# EAGLE design Qi Lime Pi Rev 1 (EAGLE 6.3)
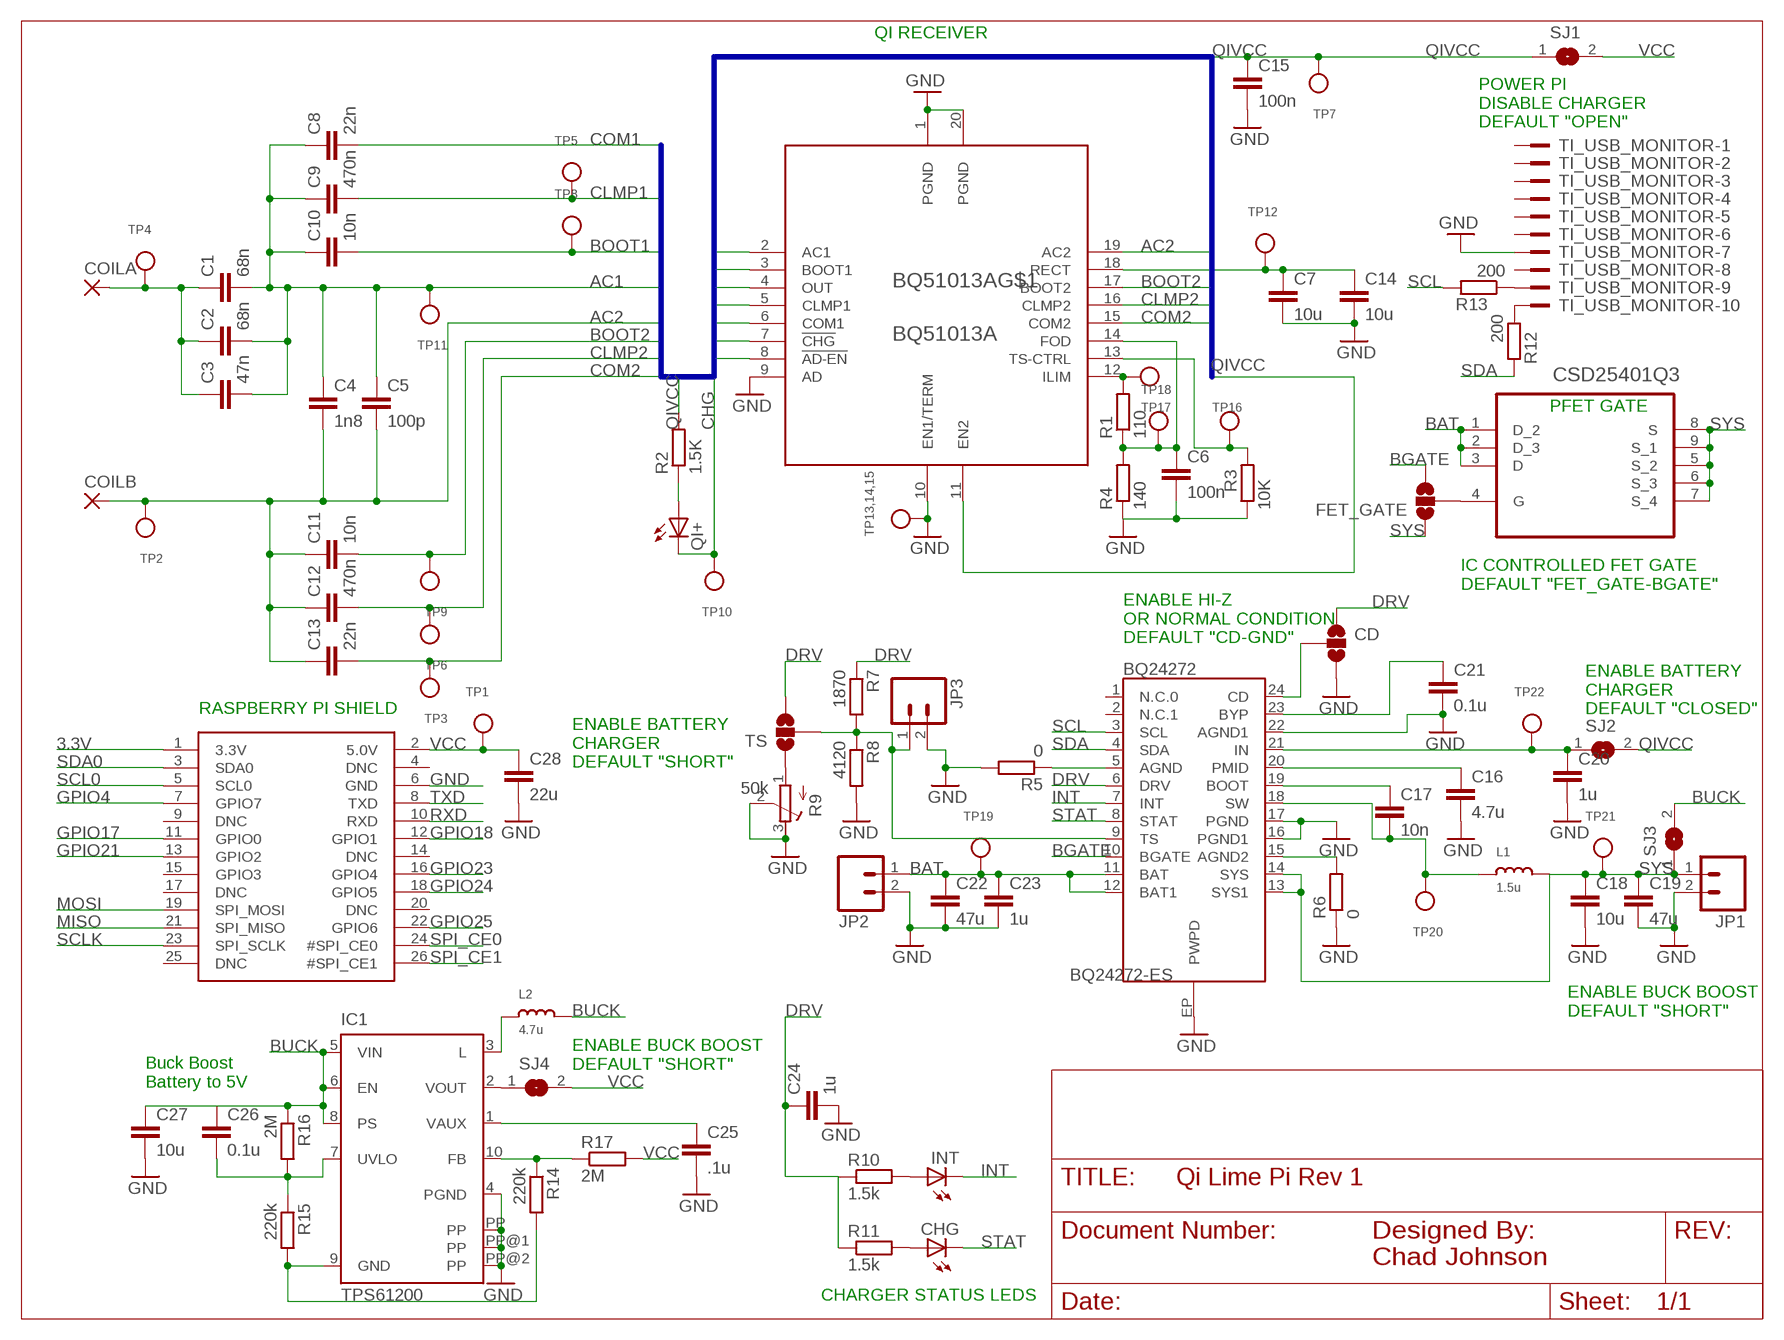
[diagram p0: schematic, sheet 1]

## Parts
BQ24272  BQ24272-ES  [QFN-24_ALT2]
BQ51013A  BQ51013A  [RHL_R-VQFN-N20]
C1  68n  C-EUC0603K  [C0603K]
C2  68n  C-EUC0603K  [C0603K]
C3  47n  C-EUC0603K  [C0603K]
C4  1n8  C-EUC0603K  [C0603K]
C5  100p  C-EUC0603K  [C0603K]
C6  100n  C-EUC0603K  [C0603K]
C7  10u  C-EUC0603K  [C0603K]
C8  22n  C-EUC0603K  [C0603K]
C9  470n  C-EUC0603K  [C0603K]
C10  10n  C-EUC0603K  [C0603K]
C11  10n  C-EUC0603K  [C0603K]
C12  470n  C-EUC0603K  [C0603K]
C13  22n  C-EUC0603K  [C0603K]
C14  10u  C-EUC0603K  [C0603K]
C15  100n  C-EUC0603K  [C0603K]
C16  4.7u  C-EUC0603K  [C0603K]
C17  10n  C-EUC0603K  [C0603K]
C18  10u  C-EUC0603K  [C0603K]
C19  47u  C-EUC0603K  [C0603K]
C20  1u  C-EUC0603K  [C0603K]
C21  0.1u  C-EUC0603K  [C0603K]
C22  47u  C-EUC0603K  [C0603K]
C23  1u  C-EUC0603K  [C0603K]
C24  1u  C-EUC0603K  [C0603K]
C25  .1u  C-EUC0603K  [C0603K]
C26  0.1u  C-EUC0603K  [C0603K]
C27  10u  C-EUC0603K  [C0603K]
C28  22u  C-EUC0603K  [C0603K]
CD  SOLDERJUMPER_2WAYS  [SJ_3]
CHG  LEDCHIP-LED0603  [CHIP-LED0603]
COILA  1,6/0,8  [1,6/0,8]
COILB  1,6/0,8  [1,6/0,8]
CSD25401Q3  CSD25401Q3  [SON65P300X300X-9N]
FET_GATE  SOLDERJUMPER_2WAYS  [SJ_3]
IC1  TPS61200  [S-PDSO-N10]
INT  LEDCHIP-LED0603  [CHIP-LED0603]
JP1  M02PTH3  [1X02_LONGPADS]
JP2  M02PTH3  [1X02_LONGPADS]
JP3  M02PTH3  [1X02_LONGPADS]
L1  1.5u  INDUCTORNR5040  [INDUCTOR_5X5MM_NR5040_NOTHERMALS]
L2  4.7u  INDUCTORNR5040  [INDUCTOR_5X5MM_NR5040_NOTHERMALS]
QI+  LEDCHIP-LED0603  [CHIP-LED0603]
R1  110  R-EU_R0402  [R0402]
R2  1.5K  R-EU_R0402  [R0402]
R3  10K  R-EU_R0402  [R0402]
R4  140  R-EU_R0402  [R0402]
R5  0  R-EU_R0402  [R0402]
R6  0  R-EU_R0402  [R0402]
R7  1870  R-EU_R0402  [R0402]
R8  4120  R-EU_R0402  [R0402]
R9  50k  R-TRIMM64Y  [RTRIM64Y]
R10  1.5k  R-EU_R0402  [R0402]
R11  1.5k  R-EU_R0402  [R0402]
R12  200  R-EU_R0402  [R0402]
R13  200  R-EU_R0402  [R0402]
R14  220k  R-EU_R0402  [R0402]
R15  220k  R-EU_R0402  [R0402]
R16  2M  R-EU_R0402  [R0402]
R17  2M  R-EU_R0402  [R0402]
SJ1  SJ  [SJ]
SJ2  SJ  [SJ]
SJ3  SJ  [SJ]
SJ4  SJ  [SJ]
TI_USB_MONITOR  2510-  [PAK100/2500-10]
TP1  TESTPOINTROUND1MM  [TESTPOINT_ROUND_1MM]
TP2  TESTPOINTROUND1MM  [TESTPOINT_ROUND_1MM]
TP3  TESTPOINTROUND1MM  [TESTPOINT_ROUND_1MM]
TP4  TESTPOINTROUND1MM  [TESTPOINT_ROUND_1MM]
TP5  TESTPOINTROUND1MM  [TESTPOINT_ROUND_1MM]
TP6  TESTPOINTROUND1MM  [TESTPOINT_ROUND_1MM]
TP7  TESTPOINTROUND1MM  [TESTPOINT_ROUND_1MM]
TP8  TESTPOINTROUND1MM  [TESTPOINT_ROUND_1MM]
TP9  TESTPOINTROUND1MM  [TESTPOINT_ROUND_1MM]
TP10  TESTPOINTROUND1MM  [TESTPOINT_ROUND_1MM]
TP11  TESTPOINTROUND1MM  [TESTPOINT_ROUND_1MM]
TP12  TESTPOINTROUND1MM  [TESTPOINT_ROUND_1MM]
TP13,14,15  TESTPOINTROUND1MM  [TESTPOINT_ROUND_1MM]
TP16  TESTPOINTROUND1MM  [TESTPOINT_ROUND_1MM]
TP17  TESTPOINTROUND1MM  [TESTPOINT_ROUND_1MM]
TP18  TESTPOINTROUND1MM  [TESTPOINT_ROUND_1MM]
TP19  TESTPOINTROUND1MM  [TESTPOINT_ROUND_1MM]
TP20  TESTPOINTROUND1MM  [TESTPOINT_ROUND_1MM]
TP21  TESTPOINTROUND1MM  [TESTPOINT_ROUND_1MM]
TP22  TESTPOINTROUND1MM  [TESTPOINT_ROUND_1MM]
TS  SOLDERJUMPER_2WAYS  [SJ_3]
U$1  RASPBERRYPI_BB  [RASBERRYPI_SHIELD]

## Nets
3.3V: U$1.1(3.3V)
AC1: BQ51013A.2(AC1) C1.2 C2.2 C3.2 C4.1 C5.1 C8.1 C9.1 C10.1 TP11.P$1
AC2: BQ51013A.19(AC2) C4.2 C5.2 C11.1 C12.1 C13.1 COILB.1(P) TP2.P$1
AD-EN: BQ51013A.8(!AD-EN)
BAT: BQ24272.11(BAT) BQ24272.12(BAT1) C22.1 C23.1 CSD25401Q3.1(D_2) CSD25401Q3.2(D_3) CSD25401Q3.3(D) JP2.1 TP19.P$1
BGATE: BQ24272.10(BGATE) FET_GATE.3
BOOT1: BQ51013A.3(BOOT1) C10.2 TP8.P$1
BOOT2: BQ51013A.17(BOOT2) C11.2 TP9.P$1
BUCK: C26.1 C27.1 IC1.5(VIN) IC1.6(EN) IC1.8(PS) L2.P$2 R16.1 SJ3.2
CHG: BQ51013A.7(!CHG) QI+.C TP10.P$1
CLMP1: BQ51013A.5(CLMP1) C9.2 TP5.P$1
CLMP2: BQ51013A.16(CLMP2) C12.2 TP6.P$1
COM1: BQ51013A.6(COM1) C8.2
COM2: BQ51013A.15(COM2) C13.2 TP3.P$1
DRV: BQ24272.6(DRV) C24.1 CD.1 R7.1 R10.1 R11.1 TS.3
FOD: BQ51013A.14(FOD) C6.1 R1.1 R4.2 TP17.P$1
GND: BQ24272.16(PGND1) BQ24272.17(PGND) BQ24272.22(AGND1) BQ24272.EP(PWPD) BQ51013A.1(PGND) BQ51013A.9(AD) BQ51013A.10(EN1/TERM) BQ51013A.20(PGND) C6.2 C7.2 C14.2 C15.2 C16.2 C18.2 C19.2 C20.2 C21.2 C22.2 C23.2 C24.2 C25.2 C27.2 C28.2 CD.3 IC1.4(PGND) IC1.PP IC1.PP@1(PP) IC1.PP@2(PP) JP1.2 JP2.2 JP3.2 R3.1 R4.1 R5.2 R6.1 R8.2 R9.2(S) R9.3(E) TI_USB_MONITOR.7 TP13,14,15.P$1 U$1.6(GND)
GPIO4: U$1.7(GPIO7)
GPIO17: U$1.11(GPIO0)
GPIO18: U$1.12(GPIO1)
GPIO21: U$1.13(GPIO2)
GPIO23: U$1.16(GPIO4)
GPIO24: U$1.18(GPIO5)
GPIO25: U$1.22(GPIO6)
INT: BQ24272.7(INT) INT.C
MISO: U$1.21(SPI_MISO)
MOSI: U$1.19(SPI_MOSI)
N$1: BQ51013A.12(ILIM) R1.2 TP18.P$1
N$2: BQ24272.5(AGND) R5.1
N$3: BQ24272.21(IN) C20.1 SJ2.1 TP22.P$1
N$4: R9.1(A) TS.1
N$5: BQ24272.20(PMID) C16.1
N$6: BQ24272.19(BOOT) C17.1
N$7: C1.1 C2.1 C3.1 COILA.1(P) TP4.P$1
N$8: BQ24272.18(SW) C17.2 L1.P$1 TP20.P$1
N$9: BQ24272.23(BYP) C21.1
N$24: BQ24272.15(AGND2) R6.2
N$71: BQ24272.24(CD) CD.2
N$72: BQ24272.9(TS) JP3.1 R7.2 R8.1 TS.2
N$73: INT.A R10.2
N$74: CHG.A R11.2
N$75: R13.1 TI_USB_MONITOR.9
N$81: R12.1 TI_USB_MONITOR.10
N$147: CSD25401Q3.4(G) FET_GATE.2
N$148: C25.1 IC1.1(VAUX)
N$149: BQ51013A.13(TS-CTRL) R3.2 TP16.P$1
N$150: QI+.A R2.1
N$151: IC1.3(L) L2.P$1
N$152: IC1.10(FB) R14.1 R17.1
N$153: C26.2 IC1.7(UVLO) R15.1 R16.2
N$154: IC1.2(VOUT) SJ4.1
N$155: IC1.9(GND) R14.2 R15.2
QIVCC: BQ51013A.4(OUT) BQ51013A.11(EN2) C15.1 R2.2 SJ1.1 SJ2.2 TP7.P$1
RECT: BQ51013A.18(RECT) C7.1 C14.1 TP12.P$1
RXD: U$1.10(RXD)
SCL: BQ24272.3(SCL) R13.2
SCL0: U$1.5(SCL0)
SCLK: U$1.23(SPI_SCLK)
SDA: BQ24272.4(SDA) R12.2
SDA0: U$1.3(SDA0)
SPI_CE0: U$1.24(#SPI_CE0)
SPI_CE1: U$1.26(#SPI_CE1)
STAT: BQ24272.8(STAT) CHG.C
SYS: BQ24272.13(SYS1) BQ24272.14(SYS) C18.1 C19.1 CSD25401Q3.5(S_2) CSD25401Q3.6(S_3) CSD25401Q3.7(S_4) CSD25401Q3.8(S) CSD25401Q3.9(S_1) FET_GATE.1 JP1.1 L1.P$2 SJ3.1 TP21.P$1
TXD: U$1.8(TXD)
VCC: C28.1 R17.2 SJ1.2 SJ4.2 TP1.P$1 U$1.2(5.0V)
Unconnected: BQ24272.1(N.C.0) BQ24272.2(N.C.1) BQ51013A.EXP@1(EXP1) BQ51013A.EXP@2(EXP2) BQ51013A.EXP@3(EXP3) BQ51013A.EXP@4(EXP4) BQ51013A.EXP@5(EXP5) BQ51013A.EXP@6(EXP6) BQ51013A.EXP@7(EXP7) TI_USB_MONITOR.1 TI_USB_MONITOR.2 TI_USB_MONITOR.3 TI_USB_MONITOR.4 TI_USB_MONITOR.5 TI_USB_MONITOR.6 TI_USB_MONITOR.8 U$1.4(DNC) U$1.9(DNC) U$1.14(DNC) U$1.15(GPIO3) U$1.17(DNC) U$1.20(DNC) U$1.25(DNC)

## Buses
AC1,BOOT1,OUT,CLMP1,COM1,CHG,AD-EN,AD,AC2,RECT,BOOT2,CLMP2,COM2,FOD,TS-CTRL,ILIM

## Notes on the sheet
- QI RECEIVER
- POWER PI
  DISABLE CHARGER
  DEFAULT "OPEN"
- PFET GATE
- IC CONTROLLED FET GATE
  DEFAULT "FET_GATE-BGATE"
- ENABLE HI-Z
  OR NORMAL CONDITION
  DEFAULT "CD-GND"
- RASPBERRY PI SHIELD
- ENABLE BATTERY
  CHARGER
  DEFAULT "CLOSED"
- ENABLE BATTERY
  CHARGER
  DEFAULT "SHORT"
- ENABLE BUCK BOOST
  DEFAULT "SHORT"
- ENABLE BUCK BOOST
  DEFAULT "SHORT"
- Buck Boost
  Battery to 5V
- Designed By:
  Chad Johnson
- CHARGER STATUS LEDS

## Library data of the parts
BQ24272 = chad1:BQ24272: Allegro A6282 16-Channel Constant-Current LED Driver Packages: TSSOP-24, 24-pin QFN Last modified: 8/20/10 Unproven!
BQ51013A = bq500211_bq500210_bq51013a:BQ51013A: Integrated Wireless Power Supply Receiver, Qi Compliant
C1 C2 = resistor:C-EU: CAPACITOR, European symbol; MF: KEMET; MPN: C0603C682K5RACTU; OC_NEWARK: 70K9097
C3 = resistor:C-EU: CAPACITOR, European symbol; MPN: C0603C473K5RACTU; OC_NEWARK: 53M7213
C4 = resistor:C-EU: CAPACITOR, European symbol; MPN: C0603C182K5RACTU; OC_NEWARK: 29T8997
C5 = resistor:C-EU: CAPACITOR, European symbol; MF: KEMET; MPN: C0603C101K5RACTU; OC_NEWARK: 72J6357
C6 C7 C9-C12 C14-C28 = resistor:C-EU: CAPACITOR, European symbol; OC_NEWARK: unknown
C8 C13 = resistor:C-EU: CAPACITOR, European symbol; MF: KEMET; MPN: C0603C223K5RACTU; OC_NEWARK: 03C3260
CD FET_GATE TS = chad1:SOLDERJUMPER_2WAY: Solder Jumper 2 way solder jumper
CHG INT = led:LED: LED
COILA COILB = wirepad:1,6/0,8: THROUGH-HOLE PAD; OC_NEWARK: unknown
CSD25401Q3 = TI-CSD25401Q3:CSD25401Q3: P-Channel NexFET Power MOSFETs,SON 3 × 3 Plastic; MPN: CSD25401Q3; OC_FARNELL: 1710779; OC_NEWARK: 15R0844; PACKAGE: SON8- 3 × 3; SUPPLIER: TEXAS INSTRUMENTS
IC1 = texas:TPS6120*: LOW INPUT VOLTAGE SYNCHRONOUS BOOST CONVERTER WITH 1.3-A SWITCHES Source: http://focus.ti.com/lit/ds/symlink/tps61200.pdf; MPN: TPS61200DRCT; OC_FARNELL: 1471238; OC_NEWARK: 37M0066
JP1-JP3 = chad1:M02: Header 2 Standard 2-pin 0.1" header. Use with straight break away headers (SKU : PRT-00116), right angle break away headers (PRT-00553), swiss pins (PRT-00743), machine pins (PRT-00117), and female headers (PRT-00115). Molex polarized connector foot print use with SKU : PRT-08233 with associated crimp pins and housings.
L1 L2 = microbuilder1:INDUCTOR: Inductors 0603: 10nH Ceramic Inductor - microwire antenna/RF (Digikey: 712-1434-2-ND) 0805: 560nH Ceramic Inductor - RF (Digikey: 553-1047-1-ND) 270nH Ceramic Inductor - Q = 40@250MHz, +-5%, 1 Ohm DC Resistance (Digikey: 535-10506-2-ND) 1007 (2518 Metric) SMT: 10µH 10% 250mOhm 820mA 1007 Inductor (Digikey: 587-2189-1-ND) 22µH 10% 500mOhm 580mA 1007 Inductor (Digikey: 587-2190-1-ND) 47µH 10% 950mOhm 420mA 1007 Inductor (Digikey: 587-2191-1-ND) 47µH 5% 100mOhm 1A 1008 Inductor (Digikey: 732-1816-1-ND) 5.0x5.0mm (Taiyo Yuden NR5040 Series) 6.8µH 20% 2.3A 64mOhm Inductor (Digikey: 587-2374-2-ND) 5.0x5.0mm (TDK VLC5045 Series) 4.7µH 20% 3.3A 34mOhm Inductor (Digikey: 445-6526-1-ND) 6.8µH 20% 2.7A 46mOhm Inductor (Digikey: 445-6527-1-ND) 6.0x6.0mm (TDK VLC6045 Series) 4.7µH 20% 3.8A 27mOhm Inductor (Digikey: 445-6538-2-ND) 6.8µH 20% 3A 41mOhm Inductor (Digikey: 445-6540-1-ND) 6.2µH 30% 2.2A 45mOhm Inductor (Digikey: SRR5028-6R2YCT-ND) - Not TDK VLC6045 but footprint should match 6.0x6.0mm (TDK SLF6045 Series) 6.8uH 30% 2A 33mOhm Inductor (Digikey: 445-4572-1-ND, Mouser: 810-SLF645T6R8N2R0PF)
QI+ = adafruit:LED: LED
R1-R8 R10-R17 = resistor:R-EU_: RESISTOR, European symbol; MPN: ERJ3EKF3000V; OC_NEWARK: 65T8414
R9 = rcl:R-TRIMM: Trimm resistor
SJ1-SJ4 = jumper:SJ: SMD solder JUMPER
TI_USB_MONITOR = con-3m:2510-: 3M (TM) Pak 100 4-Wall Header Source: 3M; MF: 3M; MPN: 2510-6002UB; OC_FARNELL: 9838244; OC_NEWARK: 46F4725
TP1-TP12 TP13,14,15 TP16-TP22 = microbuilder:TESTPOINT: Test Point Various test points for characterisation and PCB testing TESTPOINT_SMT - Compact Surface Mount Test Point [Digikey: 5016KTR-ND]
U$1 = microbuilder1:RASPBERRYPI_B

## Board
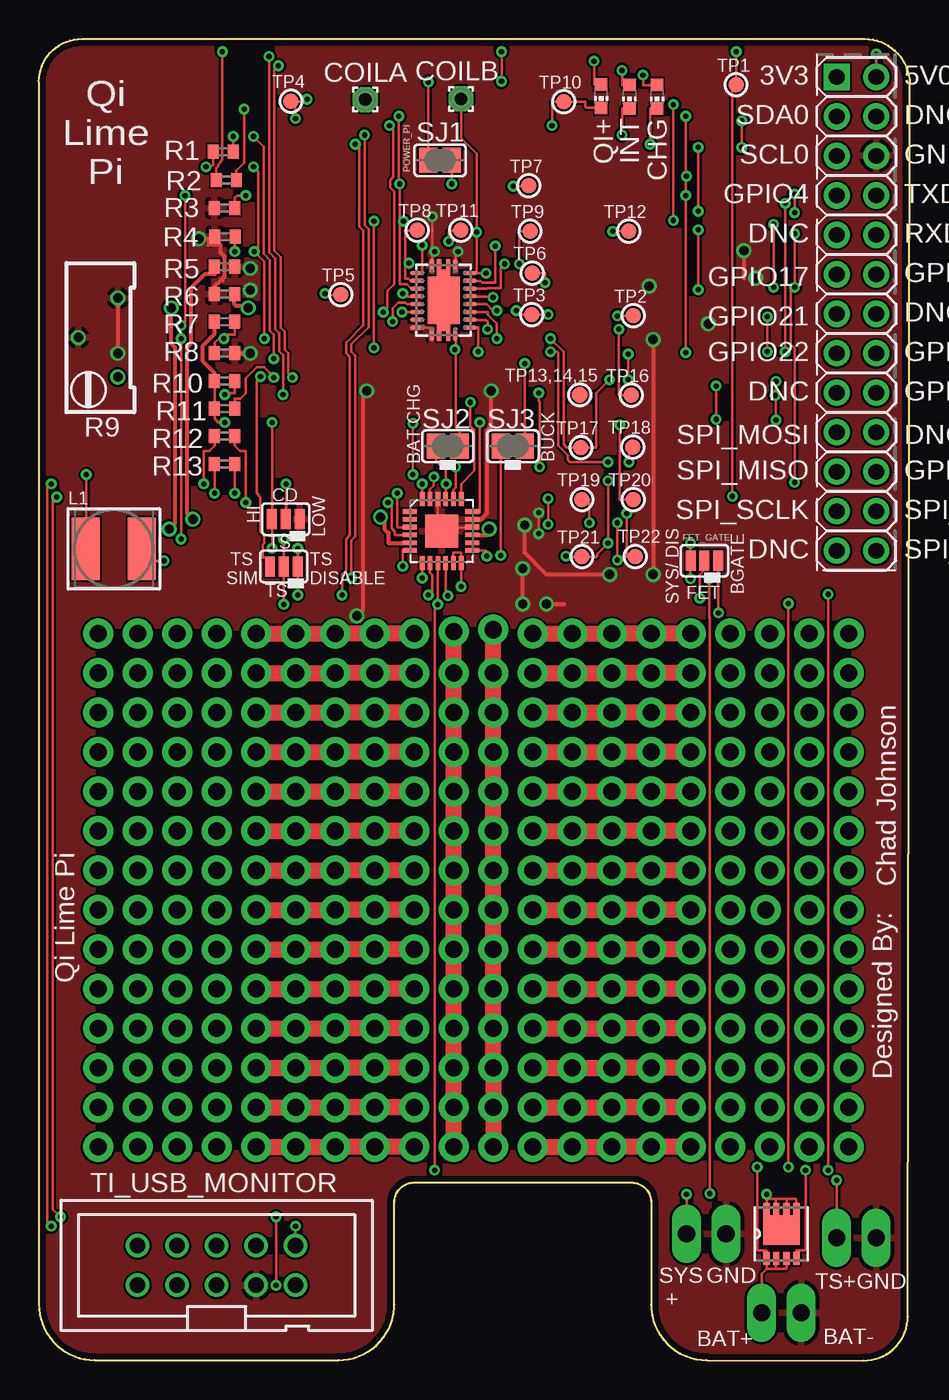
[diagram p1: board, top side]
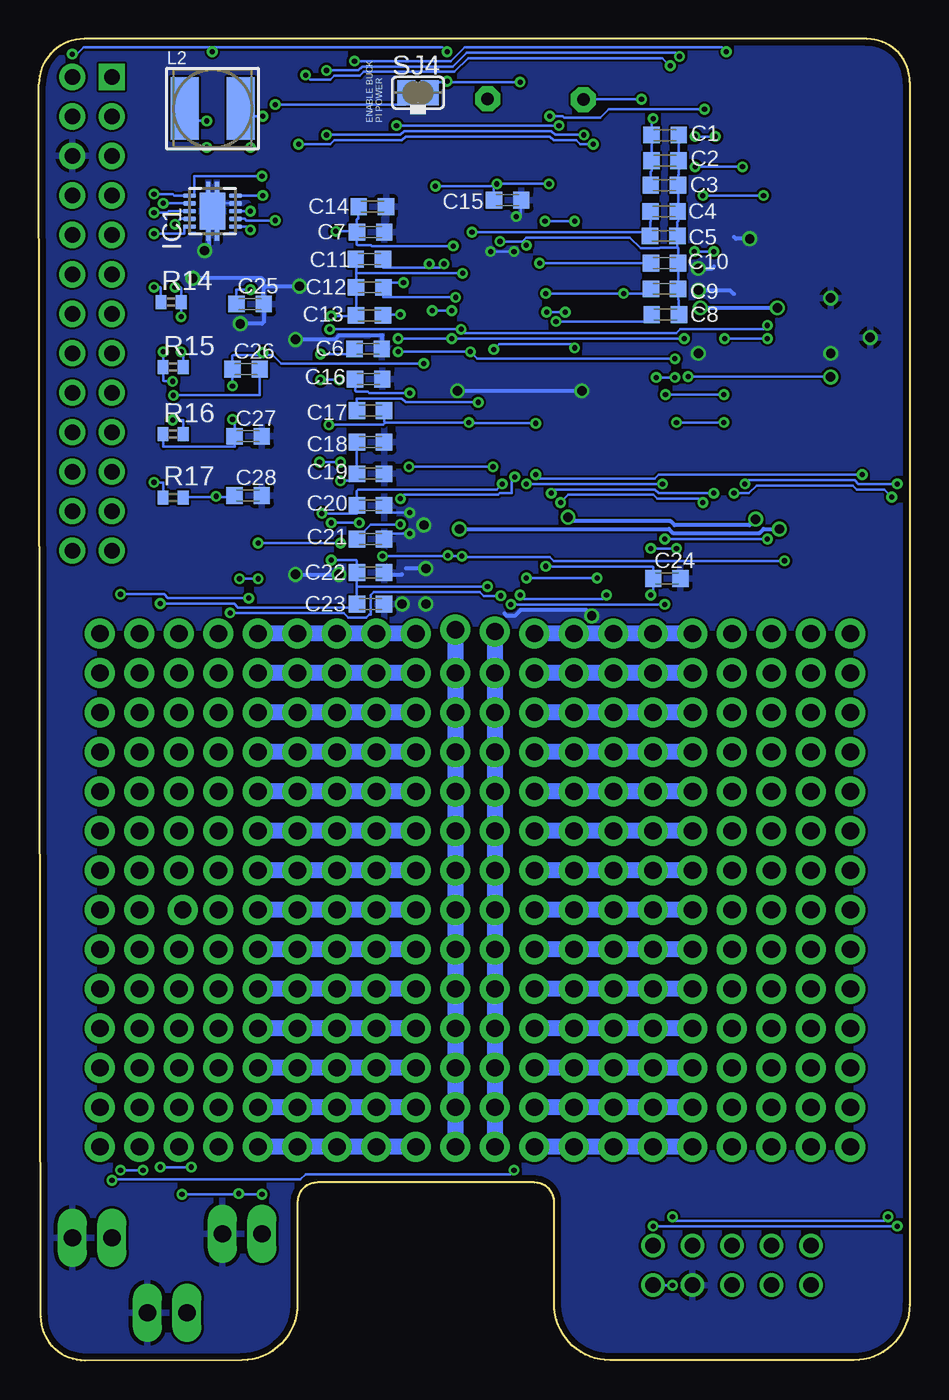
[diagram p2: board, bottom side, seen from below]

Size 56 x 85.03 mm. Coordinates in mm from the lower left corner, seen from the top.
Copper layers (1*16): Top 0.0356mm / dielectric 1.5011mm / Bottom 0.0356mm
Design rules "LaenPCBOrder": minimum track width 6mil, minimum drill 13mil, track to track 6mil, track to pad 6mil, pad to pad 6mil, via to via 6mil, smd to smd 6mil, copper to edge 15mil, drill to drill 6mil, minimum pad ring 7mil, minimum via ring 7mil, stop-mask expansion 4mil, vias tented up to drill 0mil, thermal gap 10mil

### Footprints (pad centres in the part's own frame; a part is rotated, then mirrored left to right if it is on the bottom)
QFN-24_ALT2 = smd 0.9 x 0.3: 1 -2.05,1.25; 2 -2.05,0.75; 3 -2.05,0.25; 4 -2.05,-0.25; 5 -2.05,-0.75; 6 -2.05,-1.25; 13 1.95,-1.25; 14 1.95,-0.75; 15 1.95,-0.25; 16 1.95,0.25; 17 1.95,0.75; 18 1.95,1.25 | smd 0.3 x 0.9: 7 -1.25,-2.05; 8 -0.75,-2.05; 9 -0.25,-2.05; 10 0.25,-2.05; 11 0.75,-2.05; 12 1.25,-2.05; 19 1.25,2.05; 20 0.75,2.05; 21 0.25,2.05; 22 -0.25,2.05; 23 -0.75,2.05; 24 -1.25,2.05 | smd 2.1 x 2.1: EP 0,0
RHL_R-VQFN-N20 = smd 0.85 x 0.28: 1 -2.225,-0.75; 10 2.225,-0.75; 11 2.225,0.75; 20 -2.225,0.75 | smd 0.28 x 0.85: 2 -1.75,-1.725; 3 -1.25,-1.725; 4 -0.75,-1.725; 5 -0.25,-1.725; 6 0.25,-1.725; 7 0.75,-1.725; 8 1.25,-1.725; 9 1.75,-1.725; 12 1.75,1.725; 13 1.25,1.725; 14 0.75,1.725; 15 0.25,1.725; 16 -0.25,1.725; 17 -0.75,1.725; 18 -1.25,1.725; 19 -1.75,1.725 | smd 3.05 x 2.05: EXP@1 0,0 | smd 1.125 x 0.28: EXP@2 2.075,-0.3; EXP@4 2.075,0.3; EXP@5 -2.075,0.3; EXP@7 -2.075,-0.3 | smd 0.45 x 0.4: EXP@3 1.75,0; EXP@6 -1.75,0
C0603K = smd 1.05 x 1.08: 1 -0.875,0; 2 0.875,0
SJ_3 = smd 0.635 x 1.27: 1 -0.889,0; 2 0,0; 3 0.889,0
CHIP-LED0603 = smd 0.8 x 0.8: A 0,-0.75; C 0,0.75
1,6/0,8 = drill 0.813 pad 1.6 octagon: 1 0,0
SON65P300X300X-9N = smd 0.864 x 0.406: 1 -1.575,0.965; 2 -1.575,0.33; 3 -1.575,-0.33; 4 -1.575,-0.965; 5 1.575,-0.965; 6 1.575,-0.33; 7 1.575,0.33; 8 1.575,0.965 | smd 1.9 x 2.357: 9 0.25,0
S-PDSO-N10 = smd 0.28 x 0.85: 1 -1,-1.475; 2 -0.5,-1.475; 3 0,-1.475; 4 0.5,-1.475; 5 1,-1.475; 6 1,1.475; 7 0.5,1.475; 8 0,1.475; 9 -0.5,1.475; 10 -1,1.475 | smd 2.4 x 1.65: PP 0,0 | smd 3.8 x 0.28: PP@1 0,0.275; PP@2 0,-0.275
1X02_LONGPADS = drill 1.118 pad 1.88 long: 1 0,0; 2 2.54,0
INDUCTOR_5X5MM_NR5040_NOTHERMALS = smd 1.8 x 4: P$1 -1.8,0; P$2 1.8,0
R0402 = smd 0.7 x 0.9: 1 -0.65,0; 2 0.65,0
RTRIM64Y = drill 0.61: 1 0,-2.54; 2 -2.54,0; 3 0,2.54
SJ = smd 1.168 x 1.6: 1 -0.762,0; 2 0.762,0
PAK100/2500-10 = drill 1 pad 1.422: 1 -5.08,-1.27; 2 -5.08,1.27; 3 -2.54,-1.27; 4 -2.54,1.27; 5 0,-1.27; 6 0,1.27; 7 2.54,-1.27; 8 2.54,1.27; 9 5.08,-1.27; 10 5.08,1.27
TESTPOINT_ROUND_1MM = smd 1 x 1: P$1 0,0
RASBERRYPI_SHIELD = drill 1 pad 1.676 square: 1 51.308,82.55 | drill 1 pad 1.676: 2 53.848,82.55; 3 51.308,80.01; 4 53.848,80.01; 5 51.308,77.47; 6 53.848,77.47; 7 51.308,74.93; 8 53.848,74.93; 9 51.308,72.39; 10 53.848,72.39; 11 51.308,69.85; 12 53.848,69.85; 13 51.308,67.31; 14 53.848,67.31; 15 51.308,64.77; 16 53.848,64.77; 17 51.308,62.23; 18 53.848,62.23; 19 51.308,59.69; 20 53.848,59.69; 21 51.308,57.15; 22 53.848,57.15; 23 51.308,54.61; 24 53.848,54.61; 25 51.308,52.07; 26 53.848,52.07

### Placement (x,y rotation side)
BQ24272  25.91,53.37 0 top
BQ51013A  26.03,68.22 270 top
C1  15.73,78.84 0 bottom
C2  15.74,77.18 0 bottom
C3  15.78,75.61 0 bottom
C4  15.79,73.93 180 bottom
C5  15.82,72.35 180 bottom
C6  34.83,65.09 0 bottom
C7  34.66,72.59 0 bottom
C8  15.71,67.29 180 bottom
C9  15.77,68.95 180 bottom
C10  15.77,70.59 180 bottom
C11  34.74,70.86 0 bottom
C12  34.72,69.04 0 bottom
C13  34.74,67.24 0 bottom
C14  34.55,74.23 0 bottom
C15  25.86,74.65 0 bottom
C16  34.8,63.15 0 bottom
C17  34.67,61.12 0 bottom
C18  34.67,59.08 0 bottom
C19  34.67,57.05 0 bottom
C20  34.67,55.02 0 bottom
C21  34.67,52.86 0 bottom
C22  34.67,50.7 0 bottom
C23  34.67,48.67 0 bottom
C24  15.62,50.32 0 bottom
C25  42.42,67.97 0 bottom
C26  42.67,63.78 0 bottom
C27  42.55,59.46 0 bottom
C28  42.55,55.65 0 bottom
CD  15.88,54.13 0 top
CHG  39.75,81.31 180 top
COILA  20.99,81.12 0 top
COILB  27.15,81.17 0 top
CSD25401Q3  47.75,8.16 90 top
FET_GATE  42.8,51.46 0 top
IC1  44.83,73.94 90 bottom
INT  37.97,81.31 180 top
JP1  41.66,8.16 0 top
JP2  46.48,3.08 0 top
JP3  51.31,7.9 0 top
L1  4.83,52.23 0 top
L2  44.83,80.55 0 bottom
QI+  36.16,81.34 180 top
R1  11.86,77.78 0 top
R2  12.06,75.93 0 top
R3  11.94,74.15 0 top
R4  11.97,72.31 0 top
R5  11.94,70.39 0 top
R6  11.94,68.61 0 top
R7  11.94,66.83 0 top
R8  11.94,64.8 0 top
R9  5.08,65.81 0 top
R10  11.94,63.02 0 top
R11  11.94,61.24 0 top
R12  11.94,59.46 0 top
R13  11.94,57.69 0 top
R14  47.5,68.1 0 bottom
R15  47.37,63.91 0 bottom
R16  47.37,59.59 0 bottom
R17  47.37,55.53 0 bottom
SJ1  25.8,77.22 180 top
SJ2  26.29,58.83 0 top
SJ3  30.48,58.83 0 top
SJ4  31.62,81.56 0 bottom
TI_USB_MONITOR  11.43,6.12 0 top
TP1  44.83,82.07 180 top
TP2  38.22,67.21 180 top
TP3  31.7,67.29 180 top
TP4  16.21,81.02 180 top
TP5  19.41,68.57 180 top
TP6  31.73,69.97 180 top
TP7  31.5,75.57 180 top
TP8  24.35,72.72 180 top
TP9  31.58,72.65 180 top
TP10  33.76,80.98 180 top
TP11  27.14,72.72 180 top
TP12  37.92,72.66 180 top
TP13,14,15  34.78,62.13 180 top
TP16  38.08,62.1 180 top
TP17  34.86,58.74 180 top
TP18  38.19,58.78 180 top
TP19  34.92,55.4 180 top
TP20  38.23,55.4 180 top
TP21  34.92,51.72 180 top
TP22  38.35,51.72 0 top
TS  15.75,51.08 0 top
U$1  0,0.03 0 top

### Tracks (layer width: path | path; a pad name or v marks a point on that pad's centre or on a via)
AC1  (via drill 0.33)
  Top 0.152: v24.65,71.75 24.65,69.95 24.35,69.95 BQ51013A.2 | v26.35,72 26.35,72.65 26.4,72.7 27.1,72.7 TP11.P$1
  Bottom 0.152: 24.9,72 v24.65,71.75 | v26.35,72 24.9,72 | C8.1 14.85,68.2 14.9,68.25 14.9,68.9 C9.1 14.9,69 14.9,70.55 C10.1 14.9,70.65 14.9,71.55 14.95,71.6 | C1.2 14.85,78.8 14.85,77.2 C2.2 14.85,77.15 14.85,76.3 14.9,76.25 14.9,75.65 C3.2 14.9,74 C4.1 14.9,73.9 14.9,73.3 14.95,73.25 14.95,72.4 C5.1 14.95,72.3 14.95,71.6 | 24.9,72 24.65,72.25 18,72.25 17.3,71.55 16.1,71.55 16.05,71.6 14.95,71.6
AC2  (via drill 0.33)
  Top 0.152: v37.2,67.2 38.2,67.2 TP2.P$1 | v28.75,69.95 27.8,69.95 BQ51013A.19 28.15,70 v28.15,72.6 28.15,77.65 27.15,78.65 27.15,81.15 COILB.1
  Bottom 0.152: v37.2,67.2 35.65,67.2 C13.1 35.6,67.3 35.6,69 C12.1 35.6,69.95 | C4.2 16.65,73.9 16.65,73.3 16.7,73.25 16.7,72.4 C5.2 16.75,72.6 v28.15,72.6 | 35.6,69.95 v28.75,69.95 | 35.6,69.95 35.6,70.85 C11.1
BAT  (via drill 0.33)
  Top 0.152: 47.4,5.95 47.4,6.55 CSD25401Q3.2 | 47.4,5.95 47.35,5.9 46.8,5.9 | 46.8,5.9 46.8,6.55 CSD25401Q3.1 46.8,6.65 46.8,7.05 46.75,7.1 46.2,7.1 v46.2,12.45 | CSD25401Q3.3 48.1,6.55 48.1,5.95 48.05,5.9 47.45,5.9 47.4,5.95 | 46.8,5.9 46.5,5.6 46.5,3.1 JP2.1 | BQ24272.11 26.65,51.35 26.65,52 27.1,52 27.15,51.95 27.15,51.35 BQ24272.12 27.15,51.25 v27.15,49.8 | v35.4,53.9 35.4,55.4 34.95,55.4 TP19.P$1 | v37.2,51.5 v37.2,53.9 | v48.2,48.7 v48.2,12.45
  Bottom 0.152: v37.2,53.9 v35.4,53.9 | v37.2,51.5 35.6,51.5 35.55,51.45 35.55,50.75 C22.1 35.55,50.65 35.55,49.8 | 35.55,49.8 35.55,48.7 C23.1 35.55,48.6 35.55,48.45 43.2,48.45 43.45,48.7 v48.2,48.7 | 35.55,49.8 v27.15,49.8 | v48.2,12.45 v46.2,12.45
BGATE  (via drill 0.33)
  Top 0.152: v26.3,49.2 26.15,49.35 26.15,51.3 BQ24272.10 | v43.7,48.1 FET_GATE.3
  Bottom 0.152: v26.3,49.2 27.4,49.2 27.65,49.45 34.45,49.45 34.65,49.25 34.65,48 34.75,48 34.95,47.8 36.1,47.8 36.4,48.1 v43.7,48.1
BOOT1  (via drill 0.33)
  Top 0.152: 23.55,70.6 23.55,72.7 24.3,72.7 TP8.P$1 | 23.55,70.6 23.55,69.6 23.75,69.6 23.9,69.45 24.3,69.45 BQ51013A.3 | 23.55,70.6 v23.8,70.6
  Bottom 0.152: v23.8,70.6 C10.2
BOOT2  (via drill 0.33)
  Top 0.152: v29.95,70.55 29.7,70.3 29.7,69 28.85,69 28.8,68.95 27.8,68.95 BQ51013A.17 | v30.9,70.55 30.9,72.65 31.55,72.65 TP9.P$1
  Bottom 0.152: v29.95,70.55 30.2,70.3 30.9,70.3 | 30.9,70.3 33.85,70.3 33.85,70.85 C11.2 | 30.9,70.3 v30.9,70.55
BUCK  (via drill 0.33)
  Top 0.152: v48.6,75.05 v48.6,73.85 | 41.6,76.2 v41.6,74.95 v41.6,64.85 | 41.6,76.2 v41.6,80.05 | v41.65,76.2 41.6,76.2 | v43.55,60.55 v43.55,62.7 | v31.25,64.15 31.25,58.85 SJ3.2
  Bottom 0.152: v48.6,73.85 47.75,73.85 47.65,73.95 46.35,73.95 IC1.8 | v48.6,75.05 47.4,75.05 47.3,74.95 46.35,74.95 IC1.6 46.25,74.95 46,74.95 46,76.2 v41.65,76.2 | v41.6,80.05 43.05,80.05 43.05,80.5 L2.P$2 | v41.6,74.95 IC1.5 | R16.1 48,59.55 48,58.8 43.4,58.8 43.4,59.45 C27.1 43.4,59.5 43.4,60.4 v43.55,60.55 | v43.55,62.7 43.55,63.75 C26.1 43.55,63.85 43.55,64.65 43.5,64.7 41.6,64.7 | v31.25,64.15 40.4,64.15 40.95,64.7 41.6,64.7 | 41.6,64.7 v41.6,64.85
CHG  (via drill 0.33)
  Top 0.152: QI+.C 35.2,80.6 35.15,80.65 35.15,81 33.8,81 TP10.P$1 33.7,81 33.05,81 33,80.95 v33,79.45 | v23.35,67.45 24.3,67.45 BQ51013A.7 | v22.15,67.45 22.4,67.7 22.4,68.8 22.85,69.25 22.85,75.2 22.6,75.45 22.6,75.95 22.8,76.15 22.8,79.2 v22.55,79.45
  Bottom 0.152: v22.15,67.45 v23.35,67.45 | v33,79.45 v22.55,79.45
CLMP1  (via drill 0.33)
  Top 0.152: v18.4,68.65 18.5,68.55 19.4,68.55 TP5.P$1 | v23.4,68.65 23.6,68.45 24.3,68.45 BQ51013A.5
  Bottom 0.152: C9.2 16.65,68.9 16.65,68.65 v18.4,68.65 v23.4,68.65
CLMP2  (via drill 0.33)
  Top 0.152: v32.55,69.35 32.55,69.95 31.75,69.95 TP6.P$1 | v29.2,68.4 29.2,68.45 27.8,68.45 BQ51013A.16
  Bottom 0.152: v32.55,69.35 33.85,69.35 C12.2 33.85,69 33.85,68.4 v29.2,68.4
COM1  (via drill 0.33)
  Top 0.152: v22.75,66.85 22.75,67.7 23.1,68.05 23.6,68.05 23.7,67.95 24.3,67.95 BQ51013A.6
  Bottom 0.152: v22.75,66.85 16.6,66.85 16.6,67.25 C8.2
COM2  (via drill 0.33)
  Top 0.152: v32.75,67.3 31.75,67.3 TP3.P$1 31.65,67.3 30.8,67.3 30.75,67.35 30.75,67.5 v30.7,67.55 | v29.45,67.55 29.2,67.55 28.8,67.95 27.8,67.95 BQ51013A.15
  Bottom 0.152: v32.75,67.3 33.85,67.3 33.9,67.25 C13.2 | v30.7,67.55 v29.45,67.55
DRV  (via drill 0.33)
  Top 0.152: R10.1 11.3,63 R11.1 11.3,61.2 11.3,60.6 11.55,60.35 v11.95,60.35 | v23.4,51.1 23.4,52.1 23.85,52.1 BQ24272.6 | v16.65,49.25 16.65,51.05 TS.3 16.65,51.15 v16.65,52.25 | v15,52.25 15,54.1 CD.1 15,54.2 v15,60.35
  Top 0.254: R7.1 11.3,66.83 11.3,66.07 10.54,65.31 10.54,64.29 11.3,63.53 11.3,63.02 R10.1
  Bottom 0.152: v23.4,51.1 16.55,51.1 16.5,51.05 16.5,50.35 C24.1 16.5,50.25 16.5,49.4 v16.65,49.25 | v16.65,52.25 v15,52.25 | v15,60.35 v11.95,60.35
FOD  (via drill 0.33)
  Top 0.152: v29.45,65.75 29.45,66.7 28.85,67.3 28.85,67.45 27.8,67.45 BQ51013A.14 | v32.9,65.75 33.75,64.9 33.75,58.95 33.95,58.75 TP17.P$1 34.9,58.75 35.8,58.75 35.85,58.8 35.85,62.25 v36.7,63.1 | v37.9,63.1 v37.9,64.75 | v12.6,71.35 12.6,72.25 12.65,72.3 R4.2 | v14.5,65.75 14.5,70.7 v13.85,71.35 14.1,71.2 14.1,76.5 v13.8,76.8 | v10.75,76.8 11.05,76.8 11.2,76.95 11.2,77.75 R1.1
  Bottom 0.152: v32.9,65.75 v29.45,65.75 v14.5,65.75 | v37.9,64.75 35.7,64.75 35.7,65.05 C6.1 | v36.7,63.1 v37.9,63.1 | v13.85,71.35 v12.6,71.35 | v10.75,76.8 v13.8,76.8
GND  (via drill 0.33, 0.6)
  Top 0.152: BQ24272.EP 25.9,53.35 25.65,53.35 25.65,55.4 BQ24272.22 | v26.95,71.35 26.8,71.2 26.8,70.45 BQ51013A.20 | BQ51013A.1 25.3,70.45 25.3,71.2 v25.45,71.35 25.3,71.3 v25.3,73.6 | BQ51013A.10 25.3,66 25.3,66.25 25.1,66.45 24.35,66.45 BQ51013A.9 | BQ24272.EP 25.95,53.35 26.9,53.35 26.9,53.55 26.95,53.6 27.7,53.6 BQ24272.16 27.9,53.65 BQ24272.16 | BQ24272.EP 25.9,53.4 25.7,53.4 | v32.15,53.2 v32.15,54.55
  Top 0.254: v39.24,69.12 39.24,69.24 | v43.05,66.7 43.05,66.45 | v45.34,71.4 45.34,69.62 | v10.29,72.16 10.92,72.16 10.92,71.78 11.68,71.78 11.68,71.28 11.94,71.02 11.94,69.75 11.87,69.66 11.76,69.55 | R9.3 v5.08,64.8 | R6.1 11.29,69.08 11.76,69.55 | 11.81,69.5 11.76,69.55 | R8.2 v13.59,64.8 | v31.24,53.75 31.24,51.97 32.64,50.57 v36.7,50.57 | v39.5,65.69 v39.5,50.57 | v32.64,48.67 33.78,48.67 | v31.11,48.67 v31.11,50.96 | R6.1 11.3,68.61 R6.1 | v20.45,47.91 20.83,48.29 20.83,62.13 v21.08,62.39 | v29.08,62.39 29.08,60.1 28.83,59.85 28.83,54.51 28.45,54.13 27.94,54.13 BQ24272.17 | 12.57,70.39 R5.2 12.57,70.39
  Bottom 0.152: v26.95,71.35 v25.45,71.35 | v25.3,73.6 25.2,73.7 25.05,73.7 25,73.75 C15.2 | IC1.4 43.4,74.45 44.55,74.45 44.55,74 IC1.PP | v32.15,54.55 33.8,54.55 33.8,55 C20.2 | v32.15,53.2 33.8,53.2 33.8,52.9 C21.2 | 44.6,73.95 IC1.PP@2 44.6,73.95
  Bottom 0.254: v39.24,69.12 41.4,69.12 41.47,69.05 | 41.47,69.05 41.53,68.99 C25.2 | v43.05,66.7 41.66,66.7 41.53,66.83 C25.2 | C25.2 | v46.1,69.62 41.66,69.62 41.53,69.5 41.53,69.12 41.47,69.05 | v45.34,71.4 45.09,71.66 45.09,73.94 IC1.PP@1 | 12.57,70.39 12.7,70.26 v13.59,70.26 | 11.3,72.29 11.18,72.16 v10.29,72.16 | 11.3,68.61 11.56,68.86 v13.59,68.86 | v39.5,50.57 v36.7,50.57 | v39.5,65.69 36.96,65.69 36.7,65.94 33.91,65.94 33.91,65.18 C6.2 | C23.2 33.78,48.67 33.74,48.73 | 32.64,50.57 33.78,50.57 33.91,50.7 C22.2 | v31.11,50.96 32.38,50.96 | v20.45,47.91 20.83,48.29 25.02,48.29 25.4,47.91 25.91,47.91 26.04,48.03 26.06,48.07 | v29.08,62.39 v21.08,62.39
  pour Bottom: -4.57,87.91 -4.57,0.28 59.94,-0.48 60.2,87.66
  pour Top: -4.83,87.91 -4.32,0.03 60.2,-0.23 59.94,87.66
INT  (via drill 0.33)
  Top 0.152: v37.5,78.85 37.5,80.55 37.95,80.55 INT.C | v20.95,78.85 20.95,73.05 21.2,72.8 21.2,66.5 20.1,65.4 20.1,64.9 20.35,64.65 20.35,53 20.1,52.75 v20.1,50.35 | v24.65,50.35 24.65,51.3 BQ24272.7
  Bottom 0.152: v37.5,78.85 32.75,78.85 32.5,79.1 23.05,79.1 22.8,78.85 v20.95,78.85 | v24.65,50.35 v20.1,50.35
N$1  (via drill 0.33)
  Top 0.152: v28.25,64.9 28.25,66.45 27.8,66.45 BQ51013A.12 | v32.9,64.9 33.3,64.9 33.4,64.8 33.4,58.85 34,58.25 34,57.95 34.15,57.8 v36.6,57.8 | v37.95,57.8 37.95,58.8 38.15,58.8 TP18.P$1 | v12.5,78.75 12.5,77.8 R1.2 | v13.8,78.75 14.45,78.1 14.45,71.2 14.85,70.8 14.85,66.25 15.1,66 v15.1,64.45
  Bottom 0.152: v32.9,64.9 v28.25,64.9 27.8,64.45 v15.1,64.45 | v37.95,57.8 v36.6,57.8 | v13.8,78.75 v12.5,78.75
N$2  (via drill 0.6)
  Top 0.254: v21.97,54.26 22.23,54 22.23,53.5 22.48,53.24 22.48,52.61 23.75,52.61 BQ24272.5 | v9.91,54.13 9.53,54.51 9.53,65.18 9.78,65.43 9.78,68.99 10.67,69.88 11.3,69.88 11.3,70.39 R5.1
  Bottom 0.254: v21.97,54.26 21.72,54 15.37,54 15.11,53.75 10.29,53.75 v9.91,54.13
N$3  (via drill 0.33)
  Top 0.152: 26.15,56.4 26.15,57.25 25.55,57.85 25.55,58.8 SJ2.1 | 26.15,56.4 26.15,55.45 BQ24272.21 | v37.8,54.5 37.8,51.7 38.35,51.7 TP22.P$1 | v26.2,56.4 26.15,56.4
  Bottom 0.152: v37.8,54.5 35.55,54.5 35.55,55 C20.1 35.55,55.05 35.55,55.95 35.45,56.05 26.55,56.05 v26.2,56.4
N$4  (via drill 0.33)
  Top 0.152: v14.25,63.3 14,63.05 14,55.8 14.25,55.55 14.25,53.35 14.5,53.1 14.5,52.6 14.4,52.5 14.4,51.65 14.8,51.65 14.85,51.6 14.85,51.1 TS.1
  Bottom 0.152: v14.25,63.3 5.1,63.3 R9.1
N$5  (via drill 0.33)
  Top 0.152: v26.8,57.5 26.8,56.15 26.65,56 26.65,55.45 BQ24272.20 | v32.2,57.5 32.2,61.7 32.15,61.75 v32.15,62.25
  Bottom 0.152: v32.2,57.5 v26.8,57.5 | v32.15,62.25 34.75,62.25 34.85,62.35 35.6,62.35 35.65,62.4 35.65,63.1 C16.1
N$6  (via drill 0.33)
  Top 0.152: v27.75,61.65 27.75,60.1 28,59.85 28,57.25 27.15,56.4 27.15,55.45 BQ24272.19
  Bottom 0.152: v27.75,61.65 32.4,61.65 32.65,61.9 35.55,61.9 35.55,61.15 C17.1
N$7  (via drill 0.33)
  Top 0.152: v16.5,79.9 16.5,81 16.25,81 TP4.P$1 16.55,81 17.25,81 v17.25,81.15
  Bottom 0.152: v16.5,79.9 16.6,79.8 C1.1 16.6,78.8 16.6,77.2 C2.1 16.6,77.15 16.6,76.55 16.65,76.5 16.65,75.65 C3.1 | v17.25,81.15 20.95,81.15 COILA.1
N$8  (via drill 0.33)
  Top 0.152: v28.35,60.35 28.35,54.6 27.9,54.6 BQ24272.18 | v37.35,60.2 37.35,55.4 38.2,55.4 TP20.P$1 | v3.05,57 3.05,52.25 L1.P$1 | v24.05,60.3 v24.05,57
  Bottom 0.152: 33.75,60.35 v28.35,60.35 28.3,60.3 v24.05,60.3 | 33.75,60.35 33.8,60.4 33.8,61.1 C17.2 | v37.35,60.2 33.85,60.2 33.75,60.3 33.75,60.35 | v3.05,57 16.15,57 16.4,56.75 23.8,56.75 v24.05,57
N$9  (via drill 0.33)
  Top 0.152: v25.4,56.85 25.4,56.3 25.15,56.05 25.15,55.45 BQ24272.23 | v32.75,53.8 v32.75,55.45
  Bottom 0.152: v25.4,56.85 25.6,56.65 25.6,55.8 26.35,55.8 26.45,55.7 32.5,55.7 v32.75,55.45 | v32.75,53.8 34.65,53.8 35.15,53.3 35.55,53.3 35.55,52.9 C21.1
N$10  (via drill 1.1 pad 1.93)
  other vias: 49.53,28.98
N$11  (via drill 1.1 pad 1.93)
  other vias: 49.53,23.9
N$12  (via drill 1.1 pad 1.93)
  other vias: 49.53,21.36
N$13  (via drill 1.1 pad 1.93)
  other vias: 44.45,21.36
N$14  (via drill 1.1 pad 1.93)
  other vias: 44.45,23.9
N$15  (via drill 1.1 pad 1.93)
  other vias: 44.45,26.44
N$18  (via drill 1.1 pad 1.93)
  other vias: 46.99,18.82
N$19  (via drill 1.1 pad 1.93)
  other vias: 46.99,16.28
N$21  (via drill 1.1 pad 1.93)
  other vias: 49.53,18.82
N$22  (via drill 1.1 pad 1.93)
  other vias: 49.53,16.28
N$23  (via drill 1.1 pad 1.93)
  other vias: 49.53,13.74
N$24  (via drill 0.6)
  Top 0.254: v13.46,67.72 13.46,67.85 12.7,67.85 12.57,67.97 12.57,68.61 R6.2 | v8.51,67.72 8.51,65.43 8.76,65.18 8.76,53.88 v8.38,53.5 | v28.96,53.5 28.96,53.24 28.83,53.11 27.94,53.11 BQ24272.15
  Bottom 0.254: v8.51,67.72 v13.46,67.72 | v8.38,53.5 9.4,53.5 9.65,53.24 15.24,53.24 15.49,53.5 v28.96,53.5
N$25  (via drill 1.1 pad 1.93)
  other vias: 46.99,13.74
N$26  (via drill 1.1 pad 1.93)
  other vias: 44.45,18.82
N$27  (via drill 1.1 pad 1.93)
  other vias: 8.89,44.22
N$28  (via drill 1.1 pad 1.93)
  other vias: 8.89,41.68
N$29  (via drill 1.1 pad 1.93)
  other vias: 8.89,39.14
N$30  (via drill 1.1 pad 1.93)
  other vias: 8.89,36.6
N$31  (via drill 1.1 pad 1.93)
  other vias: 8.89,34.06
N$32  (via drill 1.1 pad 1.93)
  other vias: 11.43,44.22
N$33  (via drill 1.1 pad 1.93)
  other vias: 11.43,39.14
N$34  (via drill 1.1 pad 1.93)
  other vias: 11.43,41.68
N$35  (via drill 1.1 pad 1.93)
  other vias: 11.43,36.6
N$36  (via drill 1.1 pad 1.93)
  other vias: 11.43,34.06
N$37  (via drill 1.1 pad 1.93)
  other vias: 6.35,34.06
N$38  (via drill 1.1 pad 1.93)
  other vias: 6.35,36.6
N$39  (via drill 1.1 pad 1.93)
  other vias: 6.35,39.14
N$40  (via drill 1.1 pad 1.93)
  other vias: 6.35,41.68
N$41  (via drill 1.1 pad 1.93)
  other vias: 6.35,44.22
N$42  (via drill 1.1 pad 1.93)
  other vias: 8.89,31.52
N$43  (via drill 1.1 pad 1.93)
  other vias: 8.89,28.98
N$44  (via drill 1.1 pad 1.93)
  other vias: 8.89,26.44
N$45  (via drill 1.1 pad 1.93)
  other vias: 8.89,23.9
N$46  (via drill 1.1 pad 1.93)
  other vias: 8.89,21.36
N$47  (via drill 1.1 pad 1.93)
  other vias: 11.43,31.52
N$48  (via drill 1.1 pad 1.93)
  other vias: 11.43,26.44
N$49  (via drill 1.1 pad 1.93)
  other vias: 11.43,28.98
N$50  (via drill 1.1 pad 1.93)
  other vias: 11.43,23.9
N$51  (via drill 1.1 pad 1.93)
  other vias: 11.43,21.36
N$52  (via drill 1.1 pad 1.93)
  other vias: 6.35,21.36
N$53  (via drill 1.1 pad 1.93)
  other vias: 6.35,23.9
N$54  (via drill 1.1 pad 1.93)
  other vias: 6.35,26.44
N$55  (via drill 1.1 pad 1.93)
  other vias: 6.35,28.98
N$56  (via drill 1.1 pad 1.93)
  other vias: 6.35,31.52
N$57  (via drill 1.1 pad 1.93)
  other vias: 8.89,18.82
N$58  (via drill 1.1 pad 1.93)
  other vias: 8.89,16.28
N$59  (via drill 1.1 pad 1.93)
  other vias: 8.89,13.74
N$60  (via drill 1.1 pad 1.93)
  other vias: 11.43,18.82
N$61  (via drill 1.1 pad 1.93)
  other vias: 11.43,16.28
N$62  (via drill 1.1 pad 1.93)
  other vias: 11.43,13.74
N$63  (via drill 1.1 pad 1.93)
  other vias: 6.35,13.74
N$64  (via drill 1.1 pad 1.93)
  other vias: 6.35,16.28
N$65  (via drill 1.1 pad 1.93)
  other vias: 6.35,18.82
N$66  (via drill 1.1 pad 1.93)
  other vias: 52.07,44.22
N$67  (via drill 1.1 pad 1.93)
  other vias: 52.07,41.68
N$68  (via drill 1.1 pad 1.93)
  other vias: 52.07,39.14
N$69  (via drill 1.1 pad 1.93)
  other vias: 52.07,36.6
N$70  (via drill 1.1 pad 1.93)
  other vias: 52.07,34.06
N$71  (via drill 0.33)
  Top 0.152: v24.65,56.4 24.65,55.45 BQ24272.24 | v15.9,56.4 15.9,54.15 CD.2
  Bottom 0.152: v15.9,56.4 v24.65,56.4
N$72  (via drill 0.33)
  Top 0.152: 11.9,66 12.6,66 12.6,66.8 R7.2 | 11.9,66 11.8,66 11.3,65.5 R8.1 | v15.75,48.65 15.75,51.05 TS.2 15.75,51.15 v15.75,52.85 | BQ24272.9 25.65,51.3 v25.65,48.65 25.45,48.45 v25.45,12.25 | v11.9,65.75 11.9,66 | v9.15,52.85 v9.15,65.75 | v51.3,11.6 51.3,7.95 JP3.1
  Bottom 0.152: v25.65,48.65 v15.75,48.65 | v9.15,65.75 v11.9,65.75 | v15.75,52.85 v9.15,52.85 | v51.3,11.6 51.25,11.65 39.2,11.65 38.85,12 25.7,12 v25.45,12.25
N$73  (via drill 0.33)
  Top 0.152: v37.5,83 37.5,82.05 37.95,82.05 INT.A | v14.8,83.9 14.8,71.3 15.2,70.9 15.2,66.35 15.45,66.1 15.45,64.95 15.7,64.7 v15.7,62.15 | v11.95,62.15 12.05,62.25 12.6,62.25 12.6,63 R10.2
  Bottom 0.152: v37.5,83 35.45,83 35.2,83.25 29.4,83.25 28.5,84.15 15.05,84.15 v14.8,83.9 | v11.95,62.15 v15.7,62.15
N$74  (via drill 0.33)
  Top 0.152: v38.85,82.7 38.85,82.05 CHG.A | v15.4,83.3 15.15,83.05 15.15,71.4 15.55,71 15.55,66.45 15.8,66.2 15.8,65.05 16.05,64.8 16.05,63.5 v16.3,63.25 | v15.1,63.25 14.85,63.5 14.85,63.55 14.5,63.9 14,63.9 13.3,63.2 13.3,62.25 12.95,61.9 12.6,61.9 R11.2
  Bottom 0.152: v38.85,82.7 38.55,82.4 37.25,82.4 37,82.65 35.35,82.65 35.1,82.9 29.3,82.9 28.4,83.8 15.9,83.8 v15.4,83.3 | v15.1,63.25 v16.3,63.25
N$75  (via drill 0.33)
  Top 0.152: v11.3,55.8 11.3,57.65 R13.1 | v1.15,55.55 0.9,55.3 0.9,9.75 v1.4,9.25 | v15.25,4.85 v15.25,9.25
  Bottom 0.152: v11.3,55.8 10.35,55.8 9.85,56.3 3.65,56.3 3.4,56.05 1.65,56.05 v1.15,55.55 | v1.4,9.25 1.65,9 15,9 v15.25,9.25 | v15.25,4.85 TI_USB_MONITOR.9
N$76  (via drill 1.1 pad 1.93)
  other vias: 52.07,31.52
N$77  (via drill 1.1 pad 1.93)
  other vias: 52.07,28.98
N$78  (via drill 1.1 pad 1.93)
  other vias: 52.07,26.44
N$79  (via drill 1.1 pad 1.93)
  other vias: 52.07,23.9
N$80  (via drill 1.1 pad 1.93)
  other vias: 52.07,21.36
N$81  (via drill 0.33)
  Top 0.152: v10.6,56.4 10.6,58.5 10.95,58.5 11.3,58.85 11.3,59.45 R12.1 | v0.8,56.4 0.55,56.15 0.55,8.9 v0.8,8.65 | v16.5,8.65 TI_USB_MONITOR.10
  Bottom 0.152: v10.6,56.4 10.35,56.65 3.55,56.65 3.3,56.4 v0.8,56.4 | v16.5,8.65 v0.8,8.65
N$82  (via drill 1.1 pad 1.93)
  Bottom 1.016: v26.67,46.89 26.67,13.49
N$83  (via drill 1.1 pad 1.93)
  Bottom 1.016: v29.21,47.02 29.21,13.49
N$84  (via drill 1.1 pad 1.93)
  other vias: 26.67,28.98
N$85  (via drill 1.1 pad 1.93)
  other vias: 26.67,31.52
N$86  (via drill 1.1 pad 1.93)
  other vias: 52.07,18.82
N$87  (via drill 1.1 pad 1.93)
  other vias: 52.07,16.28
N$88  (via drill 1.1 pad 1.93)
  other vias: 52.07,13.74
N$89  (via drill 1.1 pad 1.93)
  other vias: 26.67,34.06
N$90  (via drill 1.1 pad 1.93)
  other vias: 26.67,36.6
N$91  (via drill 1.1 pad 1.93)
  other vias: 26.67,18.82
N$92  (via drill 1.1 pad 1.93)
  other vias: 26.67,21.36
N$93  (via drill 1.1 pad 1.93)
  other vias: 26.67,23.9
N$94  (via drill 1.1 pad 1.93)
  other vias: 26.67,26.44
N$95  (via drill 1.1 pad 1.93)
  other vias: 29.21,34.06
N$96  (via drill 1.1 pad 1.93)
  other vias: 29.21,36.6
N$97  (via drill 1.1 pad 1.93)
  other vias: 3.81,44.22
N$98  (via drill 1.1 pad 1.93)
  other vias: 3.81,39.14
N$99  (via drill 1.1 pad 1.93)
  other vias: 3.81,41.68
N$100  (via drill 1.1 pad 1.93)
  other vias: 3.81,36.6
N$101  (via drill 1.1 pad 1.93)
  other vias: 3.81,34.06
N$102  (via drill 1.1 pad 1.93)
  other vias: 29.21,39.14
N$103  (via drill 1.1 pad 1.93)
  other vias: 29.21,41.68
N$104  (via drill 1.1 pad 1.93)
  other vias: 29.21,23.9
N$105  (via drill 1.1 pad 1.93)
  other vias: 29.21,26.44
N$106  (via drill 1.1 pad 1.93)
  other vias: 29.21,28.98
N$107  (via drill 1.1 pad 1.93)
  other vias: 3.81,31.52
N$108  (via drill 1.1 pad 1.93)
  other vias: 3.81,26.44
N$109  (via drill 1.1 pad 1.93)
  other vias: 3.81,28.98
N$110  (via drill 1.1 pad 1.93)
  other vias: 3.81,23.9
N$111  (via drill 1.1 pad 1.93)
  other vias: 3.81,21.36
N$112  (via drill 1.1 pad 1.93)
  other vias: 29.21,31.52
N$113  (via drill 1.1 pad 1.93)
  other vias: 29.21,13.74
N$114  (via drill 1.1 pad 1.93)
  other vias: 29.21,16.28
N$115  (via drill 1.1 pad 1.93)
  other vias: 3.81,18.82
N$116  (via drill 1.1 pad 1.93)
  other vias: 3.81,16.28
N$117  (via drill 1.1 pad 1.93)
  other vias: 3.81,13.74
N$118
  Top 1.016: 26.67,13.49 26.67,46.89
N$119
  Top 1.016: 29.21,18.82 29.21,47.02
N$120  (via drill 1.1 pad 1.93)
  other vias: 29.21,18.82
N$121  (via drill 1.1 pad 1.93)
  other vias: 46.99,46.76
N$122  (via drill 1.1 pad 1.93)
  other vias: 29.21,21.36
N$123  (via drill 1.1 pad 1.93)
  other vias: 49.53,46.76
N$124
  Top 1.016: 29.21,18.57 29.21,13.49
N$125  (via drill 1.1 pad 1.93)
  Top 1.016: v13.97,46.76 v16.51,46.76 v19.05,46.76 v21.59,46.76 v24.13,46.76
  Bottom 1.016: v13.97,46.76 v24.13,46.76
N$126  (via drill 1.1 pad 1.93)
  other vias: 26.67,16.28
N$127  (via drill 1.1 pad 1.93)
  Top 1.016: v31.75,46.76 v34.29,46.76 v36.83,46.76 v39.37,46.76 v41.91,46.76
  Bottom 1.016: v31.75,46.76 v41.91,46.76
N$128  (via drill 1.1 pad 1.93)
  other vias: 44.45,46.76
N$129  (via drill 1.1 pad 1.93)
  other vias: 44.45,16.28
N$130  (via drill 1.1 pad 1.93)
  other vias: 44.45,13.74
N$131  (via drill 1.1 pad 1.93)
  other vias: 8.89,46.76
N$132  (via drill 1.1 pad 1.93)
  other vias: 46.99,34.06
N$133  (via drill 1.1 pad 1.93)
  other vias: 11.43,46.76
N$134  (via drill 1.1 pad 1.93)
  other vias: 6.35,46.76
N$135  (via drill 1.1 pad 1.93)
  other vias: 49.53,31.52
N$136  (via drill 1.1 pad 1.93)
  other vias: 46.99,31.52
N$137  (via drill 1.1 pad 1.93)
  other vias: 26.67,41.68
N$138  (via drill 1.1 pad 1.93)
  other vias: 44.45,31.52
N$139  (via drill 1.1 pad 1.93)
  other vias: 44.45,28.98
N$140  (via drill 1.1 pad 1.93)
  other vias: 46.74,28.98
N$141  (via drill 1.1 pad 1.93)
  other vias: 46.99,23.9
N$142  (via drill 1.1 pad 1.93)
  other vias: 46.99,21.36
N$143  (via drill 1.1 pad 1.93)
  other vias: 3.81,46.76
N$144  (via drill 1.1 pad 1.93)
  other vias: 52.07,46.76
N$145  (via drill 1.1 pad 1.93)
  other vias: 26.67,44.22
N$146  (via drill 1.1 pad 1.93)
  other vias: 29.21,44.22
N$147  (via drill 0.33)
  Top 0.152: v49.3,12.25 49.3,7.1 48.75,7.1 48.7,7.05 48.7,6.6 CSD25401Q3.4 | v50.75,49.3 v50.75,12.25 | v42.5,49.05 42.5,50.55 42.8,50.85 FET_GATE.2
  Bottom 0.152: v50.75,12.25 v49.3,12.25 | v50.75,49.3 47.95,49.3 47.7,49.05 v42.5,49.05
N$148  (via drill 0.33)
  Top 0.152: v42.4,72.75 v42.4,68.9
  Bottom 0.152: v42.4,68.9 43.3,68.9 43.3,68 C25.1 | v42.4,72.75 42.6,72.95 IC1.1
N$149  (via drill 0.33)
  Top 0.152: v28.85,66.35 28.85,66.85 28.75,66.95 27.8,66.95 BQ51013A.13 | v37.3,66.35 37.3,62.15 37.35,62.1 38.05,62.1 TP16.P$1 | v13.3,74.95 12.75,74.95 12.6,74.8 12.6,74.2 R3.2 | v9.4,74.95 9.4,66.85 v9.15,66.6
  Bottom 0.152: v37.3,66.35 v28.85,66.35 28.6,66.1 15,66.1 14.75,66.35 9.4,66.35 v9.15,66.6 | v9.4,74.95 v13.3,74.95
N$150  (via drill 0.33)
  Top 0.152: v35.7,83.6 35.7,82.1 QI+.A | v11.8,84.2 11.8,77.25 11.65,77.1 11.65,77.05 11.55,76.95 11.55,76.85 11.4,76.7 11.4,75.95 R2.1
  Bottom 0.152: v35.7,83.6 29.5,83.6 28.6,84.5 12.1,84.5 v11.8,84.2
N$151  (via drill 0.33)
  Top 0.152: v42.4,78.05 v42.4,73.95 | v45.2,79.75 v45.2,78.05
  Bottom 0.152: v42.4,73.95 IC1.3 | v45.2,78.05 v42.4,78.05 | v45.2,79.75 46.6,79.75 46.65,79.8 46.65,80.5 L2.P$1
N$152  (via drill 0.33)
  Top 0.152: v48.6,72.5 v48.6,69.05 48.35,68.8 48.35,65.4 48.6,65.15 v48.6,56.5
  Bottom 0.152: v48.6,72.5 46.65,72.5 46.65,72.95 46.35,72.95 IC1.10 | v48.6,69.05 48.2,69.05 48.15,69 48.15,68.15 R14.1 | v48.6,56.5 48,56.5 48,55.55 R17.1
N$153  (via drill 0.33)
  Top 0.152: v48,64.9 v48,74.45 | v47.4,63 47.4,62.1 | 47.4,62.1 v47.4,60.5 | v47.35,62.1 47.4,62.1
  Bottom 0.152: v48,74.45 46.35,74.45 IC1.7 | v48,64.9 48,63.95 R15.1 48,63.85 48,63.05 47.95,63 v47.4,63 | v47.4,60.5 46.7,60.5 46.7,59.6 R16.2 | v47.35,62.1 41.8,62.1 41.8,63.75 C26.2
N$154  (via drill 0.33)
  Top 0.152: v40.8,80.8 v40.8,73.35
  Bottom 0.152: v40.8,73.35 42.65,73.35 42.75,73.45 IC1.2 | v40.8,80.8 32.45,80.8 32.4,80.85 32.4,81.55 SJ4.1
N$155  (via drill 0.33)
  Top 0.152: v47.25,69.05 v47.25,73.1 | v46.85,67.15 v46.85,64.9
  Bottom 0.152: v47.25,73.1 46.9,73.45 46.35,73.45 IC1.9 | v47.25,69.05 46.9,69.05 46.85,69 46.85,68.15 R14.2 46.85,68.05 v46.85,67.15 | v46.85,64.9 46.7,64.9 46.7,63.95 R15.2
N$156  (via drill 1.1 pad 1.93)
  other vias: 46.99,26.44
N$157  (via drill 1.1 pad 1.93)
  other vias: 26.67,39.14
N$158  (via drill 1.1 pad 1.93)
  other vias: 26.67,13.74
N$198  (via drill 1.1 pad 1.93)
  Top 1.016: v13.97,44.22 v16.51,44.22 v19.05,44.22 v21.59,44.22 v24.13,44.22
  Bottom 1.016: v13.97,44.22 v24.13,44.22
N$234  (via drill 1.1 pad 1.93)
  other vias: 46.99,44.22
N$235  (via drill 1.1 pad 1.93)
  other vias: 46.99,41.68
N$236  (via drill 1.1 pad 1.93)
  other vias: 46.99,39.14
N$237  (via drill 1.1 pad 1.93)
  other vias: 46.99,36.6
N$238  (via drill 1.1 pad 1.93)
  other vias: 49.53,26.44
N$253  (via drill 1.1 pad 1.93)
  other vias: 49.53,44.22
N$254  (via drill 1.1 pad 1.93)
  other vias: 49.53,39.14
N$255  (via drill 1.1 pad 1.93)
  other vias: 49.53,41.68
N$256  (via drill 1.1 pad 1.93)
  other vias: 49.53,36.6
N$257  (via drill 1.1 pad 1.93)
  other vias: 49.53,34.06
N$260  (via drill 1.1 pad 1.93)
  Top 1.016: v13.97,41.68 v16.51,41.68 v19.05,41.68 v21.59,41.68 v24.13,41.68
  Bottom 1.016: v13.97,41.68 v24.13,41.68
N$261  (via drill 1.1 pad 1.93)
  Top 1.016: v13.97,39.14 v16.51,39.14 v19.05,39.14 v21.59,39.14 v24.13,39.14
  Bottom 1.016: v13.97,39.14 v24.13,39.14
N$262  (via drill 1.1 pad 1.93)
  Top 1.016: v13.97,36.6 v16.51,36.6 v19.05,36.6 v21.59,36.6 v24.13,36.6
  Bottom 1.016: v13.97,36.6 v24.13,36.6
N$263  (via drill 1.1 pad 1.93)
  Top 1.016: v13.97,34.06 v16.51,34.06 v19.05,34.06 v21.59,34.06 v24.13,34.06
  Bottom 1.016: v13.97,34.06 v24.13,34.06
N$264  (via drill 1.1 pad 1.93)
  Top 1.016: v13.97,31.52 v16.51,31.52 v19.05,31.52 v21.59,31.52 v24.13,31.52
  Bottom 1.016: v13.97,31.52 v24.13,31.52
N$265  (via drill 1.1 pad 1.93)
  Top 1.016: v13.97,28.98 v16.51,28.98 v19.05,28.98 v21.59,28.98 v24.13,28.98
  Bottom 1.016: v13.97,28.98 v24.13,28.98
N$266  (via drill 1.1 pad 1.93)
  Top 1.016: v13.97,26.44 v16.51,26.44 v19.05,26.44 v21.59,26.44 v24.13,26.44
  Bottom 1.016: v13.97,26.44 v24.13,26.44
N$267  (via drill 1.1 pad 1.93)
  Top 1.016: v13.97,23.9 v16.51,23.9 v19.05,23.9 v21.59,23.9 v24.13,23.9
  Bottom 1.016: v13.97,23.9 v24.13,23.9
N$268  (via drill 1.1 pad 1.93)
  Top 1.016: v13.97,21.36 v16.51,21.36 v19.05,21.36 v21.59,21.36 v24.13,21.36
  Bottom 1.016: v13.97,21.36 v24.13,21.36
N$269  (via drill 1.1 pad 1.93)
  Top 1.016: v13.97,18.82 v16.51,18.82 v19.05,18.82 v21.59,18.82 v24.13,18.82
  Bottom 1.016: v13.97,18.82 v24.13,18.82
N$270  (via drill 1.1 pad 1.93)
  Top 1.016: v13.97,16.28 v16.51,16.28 v19.05,16.28 v21.59,16.28 v24.13,16.28
  Bottom 1.016: v13.97,16.28 v24.13,16.28
N$271  (via drill 1.1 pad 1.93)
  Top 1.016: v31.75,44.22 v34.29,44.22 v36.83,44.22 v39.37,44.22 v41.91,44.22
  Bottom 1.016: v31.75,44.22 v41.91,44.22
N$272  (via drill 1.1 pad 1.93)
  Top 1.016: v31.75,41.68 v34.29,41.68 v36.83,41.68 v39.37,41.68 v41.91,41.68
  Bottom 1.016: v31.75,41.68 v41.91,41.68
N$273  (via drill 1.1 pad 1.93)
  Top 1.016: v31.75,39.14 v34.29,39.14 v36.83,39.14 v39.37,39.14 v41.91,39.14
  Bottom 1.016: v31.75,39.14 v41.91,39.14
N$274  (via drill 1.1 pad 1.93)
  Top 1.016: v31.75,36.6 v34.29,36.6 v36.83,36.6 v39.37,36.6 v41.91,36.6
  Bottom 1.016: v31.75,36.6 v41.91,36.6
N$275  (via drill 1.1 pad 1.93)
  Top 1.016: v31.75,34.06 v34.29,34.06 v36.83,34.06 v39.37,34.06 v41.91,34.06
  Bottom 1.016: v31.75,34.06 v41.91,34.06
N$276  (via drill 1.1 pad 1.93)
  Top 1.016: v31.75,31.52 v34.29,31.52 v36.83,31.52 v39.37,31.52 v41.91,31.52
  Bottom 1.016: v31.75,31.52 v41.91,31.52
N$277  (via drill 1.1 pad 1.93)
  Top 1.016: v31.75,28.98 v34.29,28.98 v36.83,28.98 v39.37,28.98 v41.91,28.98
  Bottom 1.016: v31.75,28.98 v41.91,28.98
N$278  (via drill 1.1 pad 1.93)
  Top 1.016: v31.75,26.44 v34.29,26.44 v36.83,26.44 v39.37,26.44 v41.91,26.44
  Bottom 1.016: v31.75,26.44 v41.91,26.44
N$279  (via drill 1.1 pad 1.93)
  Top 1.016: v31.75,23.9 v34.29,23.9 v36.83,23.9 v39.37,23.9 v41.91,23.9
  Bottom 1.016: v31.75,23.9 v41.91,23.9
N$280  (via drill 1.1 pad 1.93)
  Top 1.016: v31.75,21.36 v34.29,21.36 v36.83,21.36 v39.37,21.36 v41.91,21.36
  Bottom 1.016: v31.75,21.36 v41.91,21.36
N$281  (via drill 1.1 pad 1.93)
  Top 1.016: v31.75,18.82 v34.29,18.82 v36.83,18.82 v39.37,18.82 v41.91,18.82
  Bottom 1.016: v31.75,18.82 v41.91,18.82
N$282  (via drill 1.1 pad 1.93)
  Top 1.016: v31.75,16.28 v34.29,16.28 v36.83,16.28 v39.37,16.28 v41.91,16.28
  Bottom 1.016: v31.75,16.28 v41.91,16.28
N$283  (via drill 1.1 pad 1.93)
  Top 1.016: v13.97,13.74 v16.51,13.74 v19.05,13.74 v21.59,13.74 v24.13,13.74
  Bottom 1.016: v13.97,13.74 v24.13,13.74
N$284  (via drill 1.1 pad 1.93)
  Top 1.016: v31.75,13.74 v34.29,13.74 v36.83,13.74 v39.37,13.74 v41.91,13.74
  Bottom 1.016: v31.75,13.74 v41.91,13.74
N$285  (via drill 1.1 pad 1.93)
  other vias: 44.45,34.06
N$286  (via drill 1.1 pad 1.93)
  other vias: 44.45,36.6
N$287  (via drill 1.1 pad 1.93)
  other vias: 44.45,39.14
N$288  (via drill 1.1 pad 1.93)
  other vias: 44.45,41.68
N$289  (via drill 1.1 pad 1.93)
  other vias: 44.45,44.22
QIVCC  (via drill 0.33)
  Top 0.152: 26.8,65.05 26.8,60.05 27.05,59.8 27.05,58.85 SJ2.2 | 26.8,65.05 26.8,65.95 BQ51013A.11 | v26.55,75.7 26.55,77.2 SJ1.1 | 23.2,73.3 v23.2,75.7 23.15,75.75 v23.15,80.05 | 23.2,73.3 23.2,69.25 23.65,69.25 23.95,68.95 24.3,68.95 BQ51013A.4 | v13.2,80.5 13.2,77.05 12.7,76.55 12.7,75.95 R2.2 | v30.5,75.55 31.45,75.55 TP7.P$1 | v21.55,73.3 v21.55,65.15 | 23.2,73.3 v23.45,73.3 | v26.75,65.05 26.8,65.05
  Bottom 0.152: v26.55,75.7 26.6,75.65 26.7,75.65 26.75,75.6 26.75,74.7 C15.1 | v26.55,75.7 v23.2,75.7 | v13.2,80.5 19.35,80.5 19.9,79.95 22.2,79.95 22.3,80.05 v23.15,80.05 | v30.5,75.55 26.8,75.55 v26.55,75.7 | v26.75,65.05 26.4,65.4 21.8,65.4 v21.55,65.15 | v23.45,73.3 v21.55,73.3
RECT  (via drill 0.33)
  Top 0.152: v29.35,71.7 29.35,69.35 28.5,69.35 28.4,69.45 27.8,69.45 BQ51013A.18 | v36.9,72.65 37.9,72.65 TP12.P$1
  Bottom 0.152: v29.35,71.7 34.6,71.7 34.65,71.75 35.5,71.75 35.55,71.8 35.55,72.55 C7.1 | v36.9,72.65 35.6,72.65 35.55,72.7 35.5,72.65 C7.1 | C14.1 35.45,74.2 35.45,73.45 35.5,73.45 35.55,73.4 35.55,72.75 C7.1
SCL  (via drill 0.33)
  Top 0.152: v12.6,55.8 12.6,57.65 R13.2 | v23.05,55.8 23.05,53.65 23.1,53.6 23.85,53.6 BQ24272.3
  Bottom 0.152: v12.6,55.8 16.15,55.8 16.4,56.05 22.8,56.05 v23.05,55.8
SDA  (via drill 0.33)
  Top 0.152: v13.3,55.2 13.3,58.5 12.95,58.5 12.6,58.85 12.6,59.45 R12.2 | v22.45,55.2 22.7,54.95 22.7,53.55 22.9,53.35 22.9,53.15 22.95,53.1 23.85,53.1 BQ24272.4
  Bottom 0.152: v13.3,55.2 13.55,55.45 16.25,55.45 16.5,55.7 21.95,55.7 v22.45,55.2
STAT  (via drill 0.33)
  Top 0.152: v39.3,78.25 39.3,80.55 CHG.C | v20.35,78.25 20.6,78 20.6,72.95 20.85,72.7 20.85,66.6 19.75,65.5 19.75,64.8 20,64.55 20,53.1 19.75,52.85 19.75,50.85 19.5,50.6 v19.5,49.25 | v25.05,49.25 25.3,49.5 25.3,50.55 25.15,50.7 25.15,51.3 BQ24272.8
  Bottom 0.152: v39.3,78.25 37.25,78.25 37,78.5 32.65,78.5 32.4,78.75 23.15,78.75 22.9,78.5 21.45,78.5 21.2,78.25 v20.35,78.25 | v19.5,49.25 19.75,49 24.8,49 v25.05,49.25
SYS  (via drill 0.33)
  Top 0.152: 47.4,10.35 47.4,9.75 CSD25401Q3.7 | 47.4,10.35 47.35,10.4 46.8,10.4 | 46.8,10.4 46.8,9.75 CSD25401Q3.8 | 48.1,10.35 48.1,9.75 CSD25401Q3.6 48.1,9.7 48.1,8.4 47.8,8.4 CSD25401Q3.9 | 48.1,10.35 48.05,10.4 47.45,10.4 47.4,10.35 | CSD25401Q3.5 48.7,9.75 48.7,10.35 48.65,10.4 48.15,10.4 48.1,10.35 | v46.8,10.7 46.8,10.4 | v41.65,10.7 41.65,8.2 JP1.1 | BQ24272.14 27.9,52.6 27.9,52.15 BQ24272.13 27.95,52.1 28.75,52.1 28.8,52.05 v28.8,51.75 | v33.9,51.75 33.9,51.7 34.9,51.7 TP21.P$1 34.95,51.7 35.85,51.7 35.9,51.75 35.9,51.9 v36.6,52.6 v36.6,56.6 | v41.9,52.6 41.9,51.5 FET_GATE.1 41.9,51.4 v41.9,50.3 | v29.7,51.8 29.7,58.8 SJ3.1 | v8.05,51.45 6.8,51.45 6.65,51.6 6.65,52.2 L1.P$2 | v43.15,10.75 43.15,47.8 43.1,47.85 v43.1,50.3
  Bottom 0.152: v41.65,10.7 43.15,10.7 | 43.15,10.7 v46.8,10.7 | C18.1 35.55,59.05 35.55,57.1 C19.1 35.55,57 35.55,56.6 v36.6,56.6 | 29.7,51.75 v28.8,51.75 28.75,51.7 23.15,51.7 22.9,51.45 v8.05,51.45 | 29.7,51.75 v33.9,51.75 | v36.6,52.6 v41.9,52.6 | v29.7,51.8 29.7,51.75 | v41.9,50.3 v43.1,50.3 | v43.15,10.75 43.15,10.7
VCC  (via drill 0.33)
  Top 0.152: v25.05,82.25 25.05,77.25 SJ1.2 | v44.85,84.2 44.85,82.1 TP1.P$1 44.8,82.05 44.6,82.05 v44.6,55.6 | v53.85,84.05 53.85,82.6 U$1.2 | v29.75,84.2 v29.75,82.3
  Bottom 0.152: 29.75,82.25 30.85,82.25 30.85,81.6 SJ4.2 | 29.75,82.25 v25.05,82.25 | 44.6,55.55 43.4,55.55 43.4,55.65 C28.1 | 44.6,55.55 46.7,55.55 R17.2 | 45.1,84.45 45.15,84.5 53.1,84.5 53.55,84.05 v53.85,84.05 | 45.1,84.45 v44.85,84.2 | v44.6,55.6 44.6,55.55 | v29.75,84.2 30.05,84.5 45.05,84.5 45.1,84.45 | v29.75,82.3 29.75,82.25

### Text on the board
tNames: Qi / Lime / Pi | POWER_PI | BUCK | BAT CHG | HI | LOW | TS / SIM | TS | TS / DISABLE | FET | BGATE | SYS/ DIS | Chad Johnson | Designed By: | Qi Lime Pi | GND | TS+ | GND | SYS / + | BAT+ | BAT-
bNames: ENABLE BUCK / PI POWER